# EAGLE design uv-exposure-box-display (EAGLE 6.4)
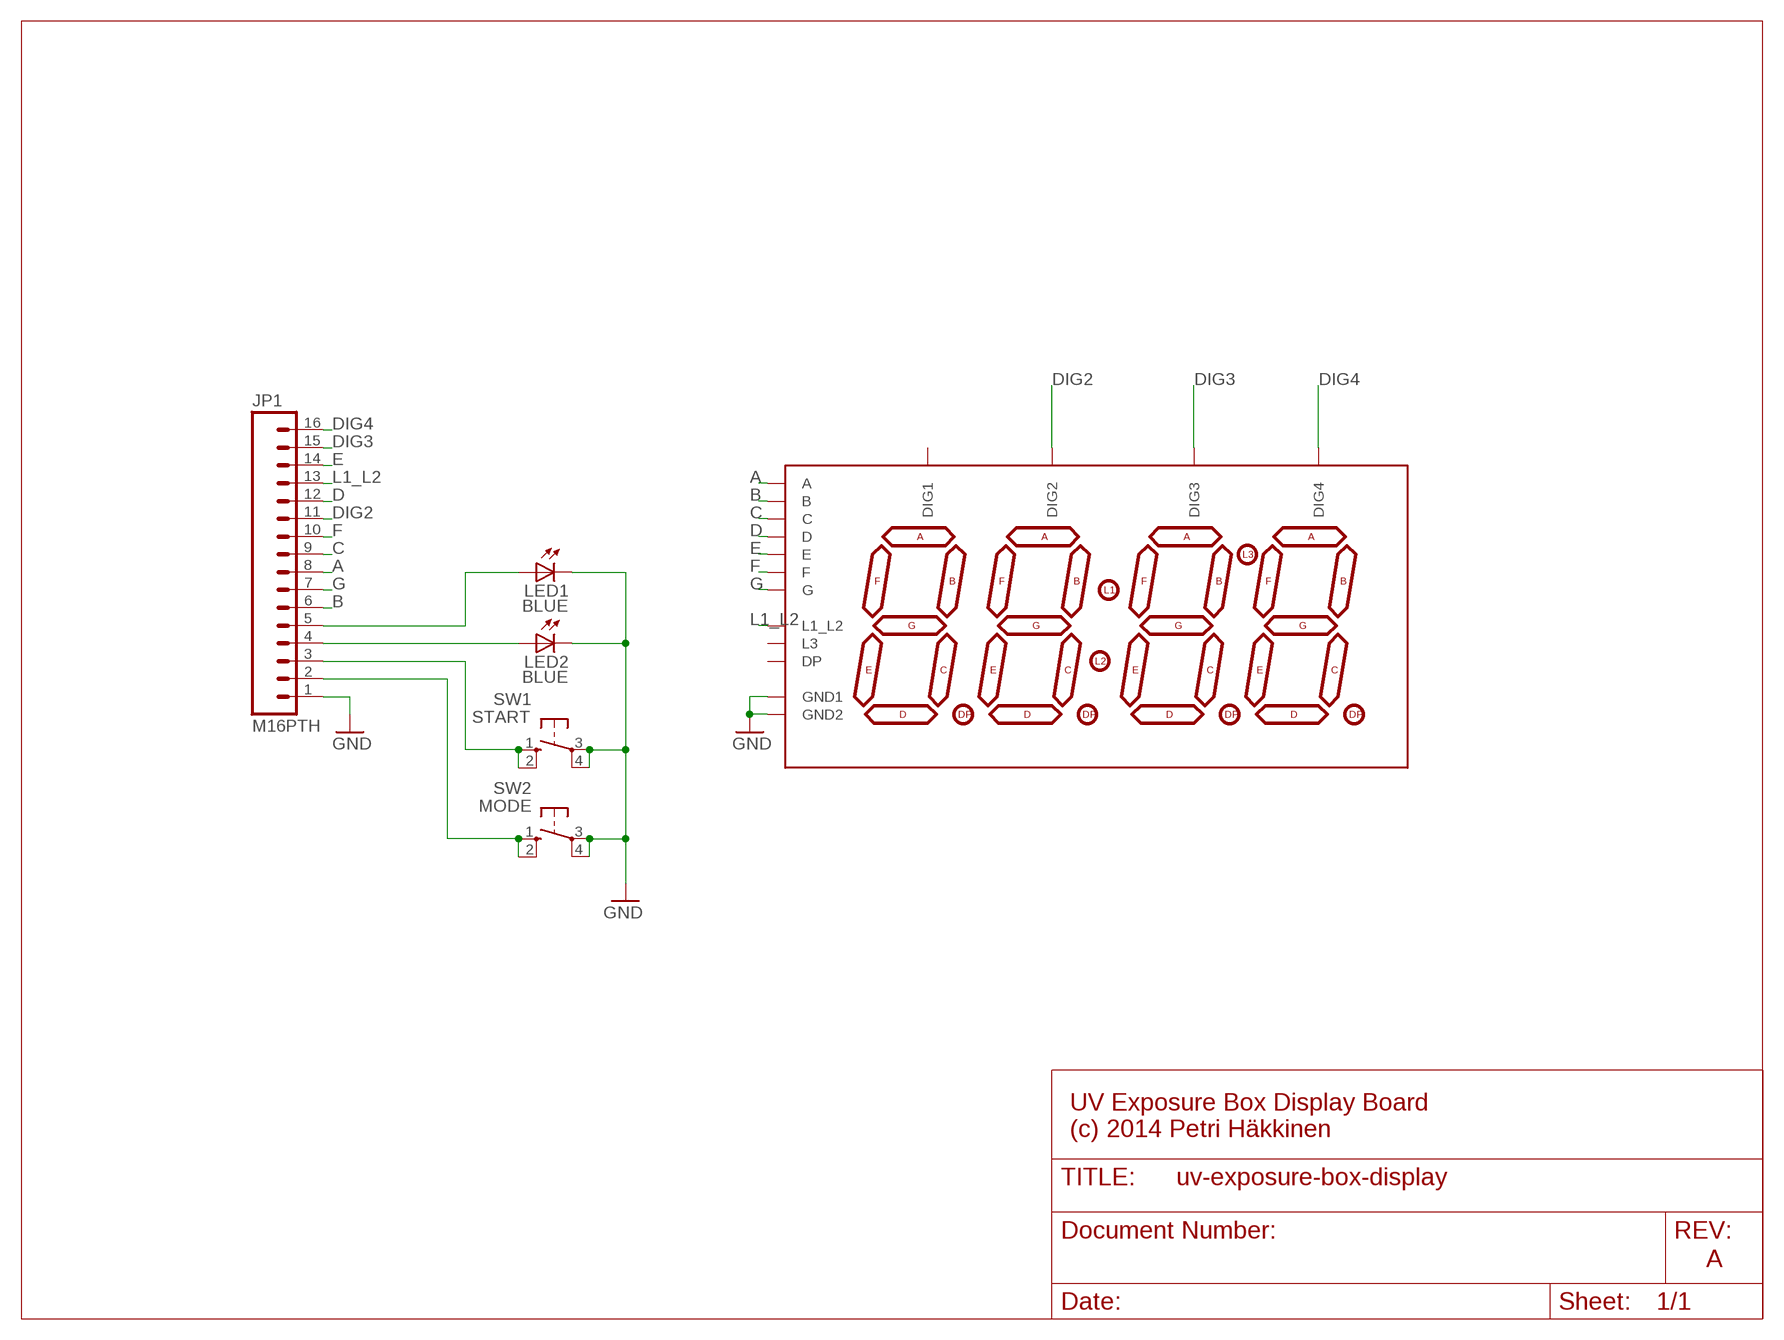
[diagram p0: schematic, sheet 1]

## Parts
JP1  M16PTH  [1X16]
LED1  BLUE  LED3MM  [LED3MM]
LED2  BLUE  LED3MM  [LED3MM]
SW1  START  10-XX  [B3F-10XX]
SW2  MODE  10-XX  [B3F-10XX]
U$1  7-SEGMENT-4DIGIT  [7-SEGMENT-4DIGIT-YOUNGSUN]

## Nets
A: JP1.8 U$1.14(A)
B: JP1.6 U$1.16(B)
C: JP1.9 U$1.13(C)
D: JP1.12 U$1.3(D)
DIG2: JP1.11 U$1.2(DIG2)
DIG3: JP1.15 U$1.6(DIG3)
DIG4: JP1.16 U$1.8(DIG4)
E: JP1.14 U$1.5(E)
F: JP1.10 U$1.11(F)
G: JP1.7 U$1.15(G)
GND: JP1.1 LED1.K(C) LED2.K(C) SW1.3(P) SW1.4(P1) SW2.3(P) SW2.4(P1) U$1.9(GND1) U$1.12(GND2)
L1_L2: JP1.13 U$1.4(L1_L2)
N$1: JP1.5 LED1.A
N$2: JP1.4 LED2.A
N$22: JP1.3 SW1.1(S) SW1.2(S1)
N$23: JP1.2 SW2.1(S) SW2.2(S1)
Unconnected: U$1.1(DIG1) U$1.7(DP) U$1.10(L3)

## Notes on the sheet
- UV Exposure Box Display Board
  (c) 2014 Petri Häkkinen
- A

## Library data of the parts
JP1 = SparkFun-Connectors:M16: 1x16 .1" header
LED1 LED2 = SparkFun-LED:LED: LEDs Standard schematic elements and footprints for 5mm, 3mm, 1206, and 0603 sized LEDs. 5mm - Spark Fun Electronics SKU : COM-00529 (and others)
SW1 SW2 = switch-omron:10-XX: OMRON SWITCH; MPN: B3F-1000; OC_FARNELL: 176432; OC_NEWARK: 36M3542
U$1 = PetenPaja:7-SEGMENT-4DIGIT

## Board
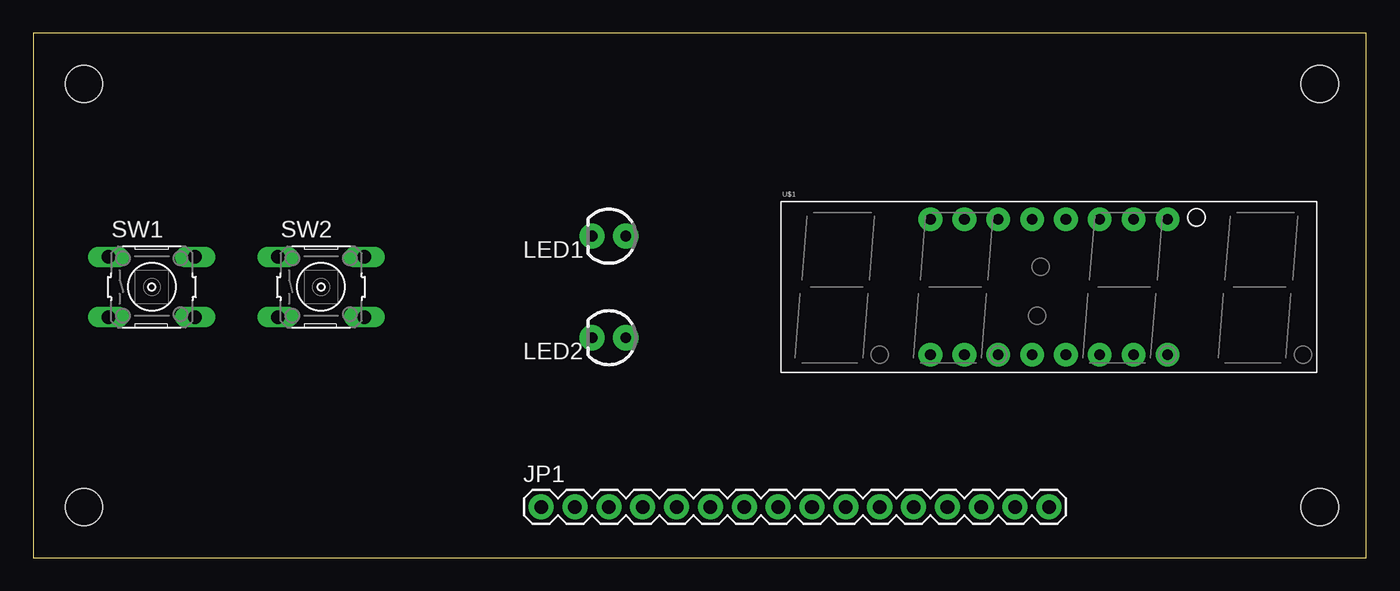
[diagram p1: board, top side]
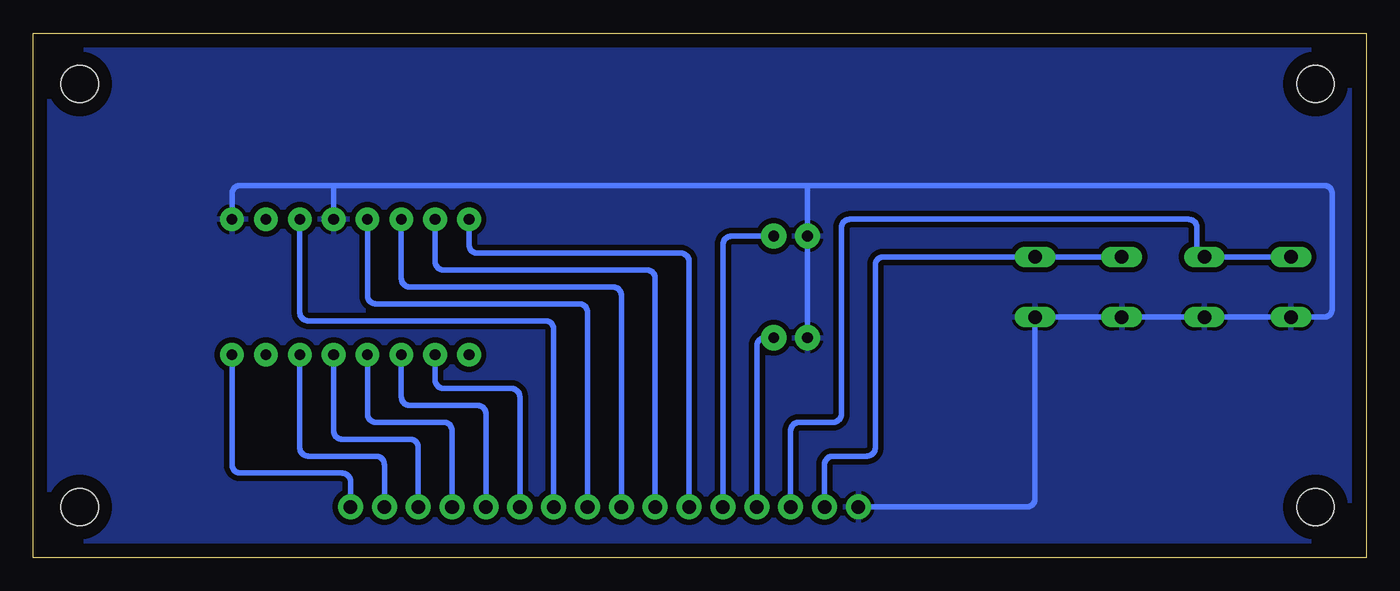
[diagram p2: board, bottom side, seen from below]

Size 100 x 39.36 mm. Coordinates in mm from the lower left corner, seen from the top.
Outline: 0,0 100,0 100,39.36 0,39.36 0,0
Copper layers (1*16): Top 0.035mm / dielectric 1.5mm / Bottom 0.035mm
Design rules "default": minimum track width 10mil, minimum drill 24mil, track to track 8mil, track to pad 8mil, pad to pad 8mil, via to via 8mil, smd to smd 8mil, copper to edge 40mil, drill to drill 8mil, minimum pad ring 10mil, minimum via ring 8mil, stop-mask expansion 4mil, vias tented up to drill 0mil, thermal gap 10mil
Holes 2.8 mm at 3.81,35.56 3.81,3.81 96.52,3.81 96.52,35.56

### Footprints (pad centres in the part's own frame; a part is rotated, then mirrored left to right if it is on the bottom)
1X16 = drill 1.016 pad 1.88: 1 0,0; 2 2.54,0; 3 5.08,0; 4 7.62,0; 5 10.16,0; 6 12.7,0; 7 15.24,0; 8 17.78,0; 9 20.32,0; 10 22.86,0; 11 25.4,0; 12 27.94,0; 13 30.48,0; 14 33.02,0; 15 35.56,0; 16 38.1,0
LED3MM = drill 0.813 pad 1.88: A -1.27,0; K 1.27,0
B3F-10XX = drill 1.016 long: 1 -3.251,2.261; 2 3.251,2.261; 3 -3.251,-2.261; 4 3.251,-2.261
7-SEGMENT-4DIGIT-YOUNGSUN = drill 0.8 pad 1.778: 1 -8.89,-5.08; 2 -6.35,-5.08; 3 -3.81,-5.08; 4 -1.27,-5.08; 5 1.27,-5.08; 6 3.81,-5.08; 7 6.35,-5.08; 8 8.89,-5.08; 9 8.89,5.08; 10 6.35,5.08; 11 3.81,5.08; 12 1.27,5.08; 13 -1.27,5.08; 14 -3.81,5.08; 15 -6.35,5.08; 16 -8.89,5.08

### Placement (x,y rotation side)
JP1  38.1,3.81 0 top
LED1  43.18,24.13 180 top
LED2  43.18,16.51 180 top
SW1  8.89,20.32 0 top
SW2  21.59,20.32 0 top
U$1  76.2,20.32 0 top

### Tracks (layer width: path | path; a pad name or v marks a point on that pad's centre or on a via)
A
  Bottom 0.406: JP1.8 55.88,19.68 arc-90 56.52,20.32 71.75,20.32 arc90 72.39,20.95 U$1.14
B
  Bottom 0.406: JP1.6 50.8,22.23 arc-90 51.44,22.86 66.67,22.86 arc90 67.31,23.5 U$1.16
C
  Bottom 0.406: JP1.9 58.42,18.41 arc-90 59.05,19.05 74.3,19.05 arc90 74.93,19.68 U$1.13
D
  Bottom 0.406: JP1.12 66.04,10.79 arc-90 66.67,11.43 71.75,11.43 arc90 72.39,12.06 U$1.3
DIG2
  Bottom 0.406: JP1.11 63.5,12.06 arc-90 64.14,12.7 69.22,12.7 arc90 69.85,13.34 U$1.2
DIG3
  Bottom 0.406: JP1.15 73.66,6.99 arc-90 74.3,7.62 79.38,7.62 arc90 80.01,8.26 U$1.6
DIG4
  Bottom 0.406: JP1.16 76.2,5.71 arc-90 76.83,6.35 84.45,6.35 arc90 85.09,6.99 U$1.8
E
  Bottom 0.406: JP1.14 71.12,8.26 arc-90 71.75,8.89 76.83,8.89 arc90 77.47,9.53 U$1.5
F
  Bottom 0.406: JP1.10 60.96,17.14 arc-90 61.59,17.78 79.38,17.78 arc90 80.01,18.41 U$1.11
G
  Bottom 0.406: JP1.7 53.34,20.95 arc-90 53.98,21.59 69.22,21.59 arc90 69.85,22.23 U$1.15
GND
  Bottom 0.406: U$1.9 85.09,27.3 arc90 84.45,27.94 77.47,27.94 | 77.47,27.94 U$1.12 | 41.91,27.94 3.17,27.94 arc90 2.54,27.3 2.54,18.69 arc90 3.17,18.06 SW1.3 SW1.4 SW2.3 SW2.4 24.84,4.45 arc90 25.48,3.81 JP1.1 | 41.91,27.94 77.47,27.94 | 41.91,27.94 LED1.K LED2.K
  pour Bottom (isolate 0.406): 1.27,38.1 99.06,38.1 99.06,1.27 1.27,1.27 1.27,2.54
L1_L2
  Bottom 0.406: JP1.13 68.58,9.53 arc-90 69.22,10.16 74.3,10.16 arc90 74.93,10.79 U$1.4
N$1
  Bottom 0.406: LED1.A 47.62,24.13 arc-90 48.26,23.5 JP1.5
N$2
  Bottom 0.406: JP1.4 45.72,15.88 arc90 45.09,16.51 LED2.A
N$22
  Bottom 0.406: SW1.1 SW1.2 12.7,22.58 12.7,24.77 arc-90 13.34,25.4 38.73,25.4 arc-90 39.37,24.77 39.37,10.79 arc90 40.01,10.16 42.55,10.16 arc-90 43.18,9.53 JP1.3
N$23
  Bottom 0.406: SW2.1 SW2.2 36.2,22.58 arc-90 36.83,21.95 36.83,8.26 arc90 37.47,7.62 40.01,7.62 arc-90 40.64,6.99 JP1.2